# EAGLE design design (EAGLE 9.5.1)
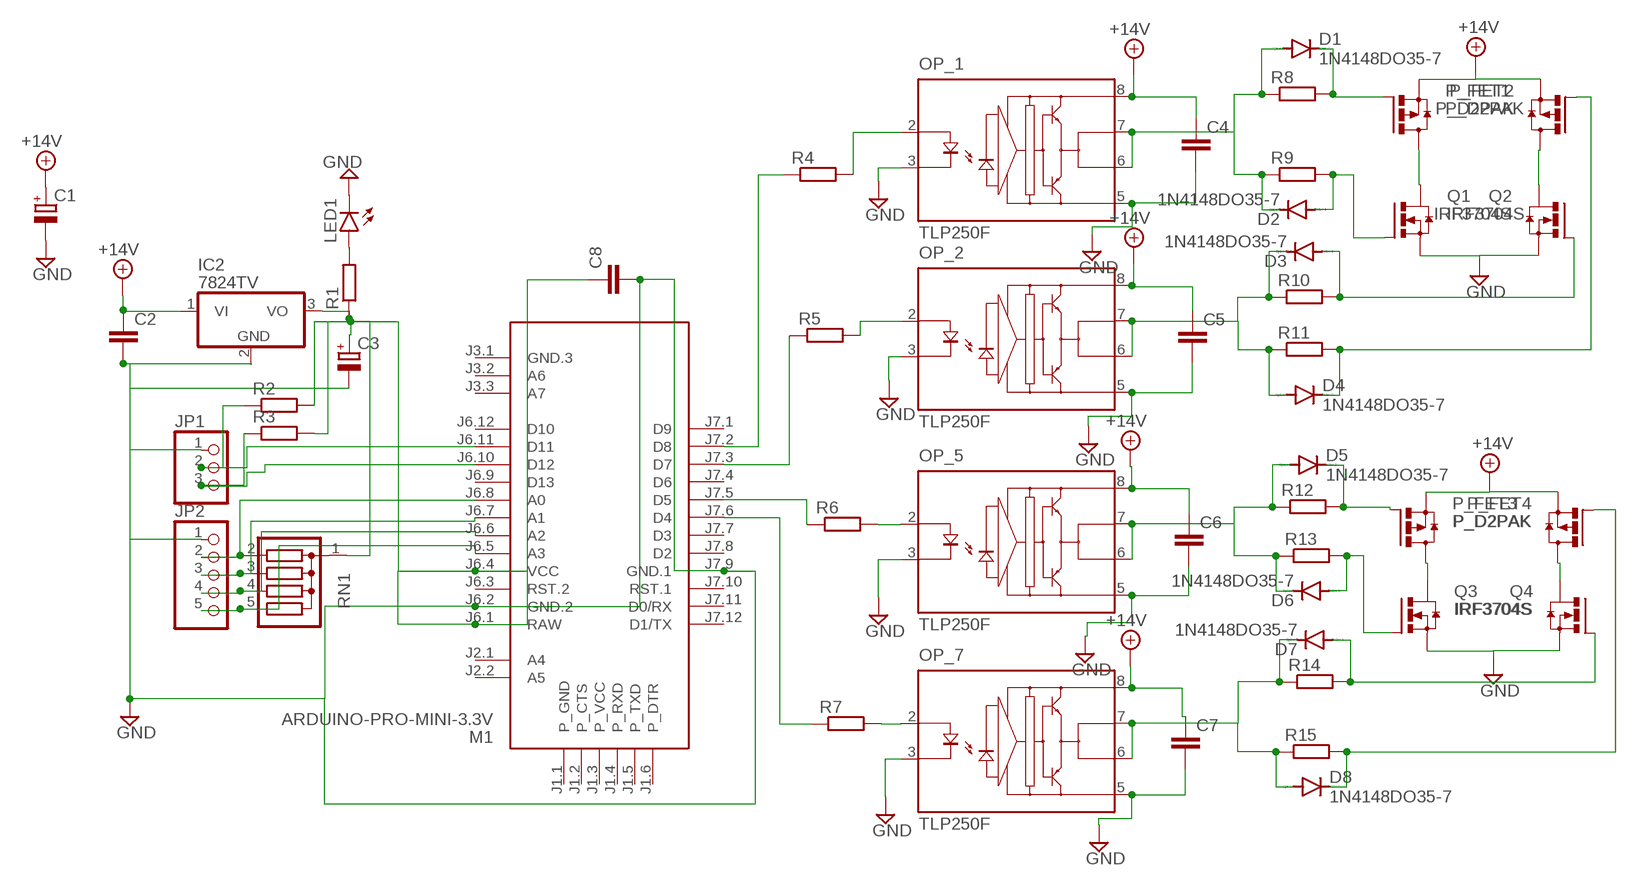
[diagram p0: schematic, sheet 1]

## Parts
C1  CPOL-EUE5-13  [E5-13]
C2  C-EU050-024X044  [C050-024X044]
C3  CPOL-EUE2.5-5  [E2,5-5]
C4  C-EU050-024X044  [C050-024X044]
C5  C-EU050-024X044  [C050-024X044]
C6  C-EU050-024X044  [C050-024X044]
C7  C-EU050-024X044  [C050-024X044]
C8  C-EU050-024X044  [C050-024X044]
D1  1N4148DO35-7  [DO35-7]
D2  1N4148DO35-7  [DO35-7]
D3  1N4148DO35-7  [DO35-7]
D4  1N4148DO35-7  [DO35-7]
D5  1N4148DO35-7  [DO35-7]
D6  1N4148DO35-7  [DO35-7]
D7  1N4148DO35-7  [DO35-7]
D8  1N4148DO35-7  [DO35-7]
IC2  7824TV  [TO220V]
JP1  PINHD-1X3  [1X03]
JP2  PINHD-1X5  [1X05]
LED1  LED5MM  [LED5MM]
M1  ARDUINO-PRO-MINI-3.3V  [ARDUINO-PRO-MINI]
OP_1  TLP250F  [DIL08]
OP_2  TLP250F  [DIL08]
OP_5  TLP250F  [DIL08]
OP_7  TLP250F  [DIL08]
P_FET1  P_D2PAK  [D2PACK]
P_FET2  P_D2PAK  [D2PACK]
P_FET3  P_D2PAK  [D2PACK]
P_FET4  P_D2PAK  [D2PACK]
Q1  IRF3704S  [D2PACK]
Q2  IRF3704S  [D2PACK]
Q3  IRF3704S  [D2PACK]
Q4  IRF3704S  [D2PACK]
R1  R-EU_0207/7  [0207/7]
R2  R-EU_0207/7  [0207/7]
R3  R-EU_0207/7  [0207/7]
R4  R-EU_0207/7  [0207/7]
R5  R-EU_0207/7  [0207/7]
R6  R-EU_0207/7  [0207/7]
R7  R-EU_0207/7  [0207/7]
R8  R-EU_0207/7  [0207/7]
R9  R-EU_0207/7  [0207/7]
R10  R-EU_0207/7  [0207/7]
R11  R-EU_0207/7  [0207/7]
R12  R-EU_0207/7  [0207/7]
R13  R-EU_0207/7  [0207/7]
R14  R-EU_0207/7  [0207/7]
R15  R-EU_0207/7  [0207/7]
RN1  G04R  [SIL5]

## Nets
+14V: C1.+ C2.1 C4.1 C5.1 C6.1 C7.1 IC2.1(VI) OP_1.8(VCC) OP_2.8(VCC) OP_5.8(VCC) OP_7.8(VCC) P_FET1.3(S) P_FET2.3(S) P_FET3.3(S) P_FET4.3(S)
GND: C1.- C2.2 C3.- C4.2 C5.2 C6.2 C7.2 C8.2 IC2.2(GND) JP1.1 JP2.1 LED1.K(C) M1.J6.2(GND.2) M1.J7.9(GND.1) OP_1.3(K) OP_1.5(GND) OP_2.3(K) OP_2.5(GND) OP_5.3(K) OP_5.5(GND) OP_7.3(K) OP_7.5(GND) Q1.3(S) Q2.3(S) Q3.3(S) Q4.3(S)
N$1: C3.+ C8.1 IC2.3(VO) M1.J6.1(RAW) M1.J6.4(VCC) R1.1 R2.2 R3.2 RN1.1
N$2: JP1.2 M1.J6.11(D11) R2.1
N$3: LED1.A R1.2
N$4: JP1.3 M1.J6.10(D12) R3.1
N$5: JP2.2 M1.J6.8(A0) RN1.2
N$6: JP2.3 M1.J6.7(A1) RN1.3
N$7: JP2.4 M1.J6.6(A2) RN1.4
N$8: M1.J7.2(D8) R4.1
N$9: OP_1.2(A) R4.2
N$10: M1.J7.3(D7) R5.1
N$11: M1.J7.5(D5) R6.1
N$12: OP_2.2(A) R5.2
N$13: OP_5.2(A) R6.2
N$14: OP_7.2(A) R7.2
N$15: M1.J7.6(D4) R7.1
N$17: D1.A D2.C OP_1.6(VO) OP_1.7(VO') R8.1 R9.1
N$18: D3.C D4.A OP_2.6(VO) OP_2.7(VO') R10.1 R11.1
N$19: D5.A D6.C OP_5.6(VO) OP_5.7(VO') R12.1 R13.1
N$20: D7.C D8.A OP_7.6(VO) OP_7.7(VO') R14.1 R15.1
N$21: P_FET3.2(D) Q3.2(D)
N$22: D3.A Q2.1(G) R10.2
N$23: D2.A Q1.1(G) R9.2
N$24: D4.C P_FET2.1(G) R11.2
N$25: D5.C P_FET3.1(G) R12.2
N$26: P_FET1.2(D) Q1.2(D)
N$27: D6.A Q3.1(G) R13.2
N$28: D7.A Q4.1(G) R14.2
N$29: P_FET2.2(D) Q2.2(D)
N$30: D8.C P_FET4.1(G) R15.2
N$31: P_FET4.2(D) Q4.2(D)
N$32: D1.C P_FET1.1(G) R8.2
N$33: JP2.5 M1.J6.5(A3) RN1.5
Unconnected: M1.J1.1(P_GND) M1.J1.2(P_CTS) M1.J1.3(P_VCC) M1.J1.4(P_RXD) M1.J1.5(P_TXD) M1.J1.6(P_DTR) M1.J2.1(A4) M1.J2.2(A5) M1.J3.1(GND.3) M1.J3.2(A6) M1.J3.3(A7) M1.J6.3(RST.2) M1.J6.9(D13) M1.J6.12(D10) M1.J7.1(D9) M1.J7.4(D6) M1.J7.7(D3) M1.J7.8(D2) M1.J7.10(RST.1) M1.J7.11(D0/RX) M1.J7.12(D1/TX)

## Library data of the parts
C1 C3 = rcl:CPOL-EU: POLARIZED CAPACITOR, European symbol; SPICEPREFIX: C
C2 C4-C8 = rcl:C-EU: CAPACITOR, European symbol; SPICEPREFIX: C
D1-D8 = diode:1N4148: DIODE high speed (Philips)
IC2 = linear:78*: Positive VOLTAGE REGULATOR Source: http://cache.national.com/ds/LM/LM78L05.pdf http://www.fairchildsemi.com/ds/LM/LM7805.pdf
JP1 = pinhead:PINHD-1X3: PIN HEADER
JP2 = pinhead:PINHD-1X5: PIN HEADER
LED1 = led:LED: LED OSRAM: - CHIPLED LG R971, LG N971, LY N971, LG Q971, LY Q971, LO R971, LY R971 LH N974, LH R974 LS Q976, LO Q976, LY Q976 LO Q996 - Hyper CHIPLED LW Q18S LB Q993, LB Q99A, LB R99A - SideLED LS A670, LO A670, LY A670, LG A670, LP A670 LB A673, LV A673, LT A673, LW A673 LH A674 LY A675 LS A676, LA A676, LO A676, LY A676, LW A676 LS A679, LY A679, LG A679 - Hyper Micro SIDELED® LS Y876, LA Y876, LO Y876, LY Y876 LT Y87S - SmartLED LW L88C, LW L88S LB L89C, LB L89S, LG L890 LS L89K, LO L89K, LY L89K LS L896, LA L896, LO L896, LY L896 - TOPLED LS T670, LO T670, LY T670, LG T670, LP T670 LSG T670, LSP T670, LSY T670, LOP T670, LYG T670 LG T671, LOG T671, LSG T671 LB T673, LV T673, LT T673, LW T673 LH T674 LS T676, LA T676, LO T676, LY T676, LB T676, LH T676, LSB T676, LW T676 LB T67C, LV T67C, LT T67C, LS T67K, LO T67K, LY T67K, LW E67C LS E67B, LA E67B, LO E67B, LY E67B, LB E67C, LV E67C, LT E67C LW T67C LS T679, LY T679, LG T679 LS T770, LO T770, LY T770, LG T770, LP T770 LB T773, LV T773, LT T773, LW T773 LH T774 LS E675, LA E675, LY E675, LS T675 LS T776, LA T776, LO T776, LY T776, LB T776 LHGB T686 LT T68C, LB T68C - Hyper Mini TOPLED® LB M676 - Mini TOPLED Santana® LG M470 LS M47K, LO M47K, LY M47K Source: http://www.osram.convergy.de LUXEON: - LUMILED® LXK2-PW12-R00, LXK2-PW12-S00, LXK2-PW14-U00, LXK2-PW14-V00 LXK2-PM12-R00, LXK2-PM12-S00, LXK2-PM14-U00 LXK2-PE12-Q00, LXK2-PE12-R00, LXK2-PE12-S00, LXK2-PE14-T00, LXK2-PE14-U00 LXK2-PB12-K00, LXK2-PB12-L00, LXK2-PB12-M00, LXK2-PB14-N00, LXK2-PB14-P00, LXK2-PB14-Q00 LXK2-PR12-L00, LXK2-PR12-M00, LXK2-PR14-Q00, LXK2-PR14-R00 LXK2-PD12-Q00, LXK2-PD12-R00, LXK2-PD12-S00 LXK2-PH12-R00, LXK2-PH12-S00 LXK2-PL12-P00, LXK2-PL12-Q00, LXK2-PL12-R00 Source: www.luxeon.com KINGBRIGHT: KA-3528ASYC Source: www.kingbright.com
M1 = diy-modules:ARDUINO-PRO-MINI-*: Arduino Pro Mini and compatible devices More details available here: https://www.arduino.cc/en/Main/ArduinoBoardProMini Click here to find device on ebay.com <http://www.ebay.com/sch/arduino+pro+mini>
OP_1 OP_2 OP_5 OP_7 = optocoupler-3-jcn:TLP250F: Toshiba Transistor Inverter Inverter For Air Conditionor IGBT Gate Drive Power MOS FET Gate Drive
P_FET1-P_FET4 = transistor-power:P_D2PAK
Q1 Q2 Q4 = transistor-power:IRF3704: SMPS MOSFET HEXFET® Power MOSFET Source: http://www.irf.com/product-info/datasheets/data/irf3704.pdf
Q3 = transistor-power:IRF3704: SMPS MOSFET HEXFET® Power MOSFET Source: http://www.irf.com/product-info/datasheets/data/irf3704.pdf; SPICEPREFIX: Q
R1-R15 = rcl:R-EU_: RESISTOR, European symbol; SPICEPREFIX: R
RN1 = resistor-sil:G04R: SIL RESISTOR; OC_FARNELL: unknown; OC_NEWARK: unknown

## Board
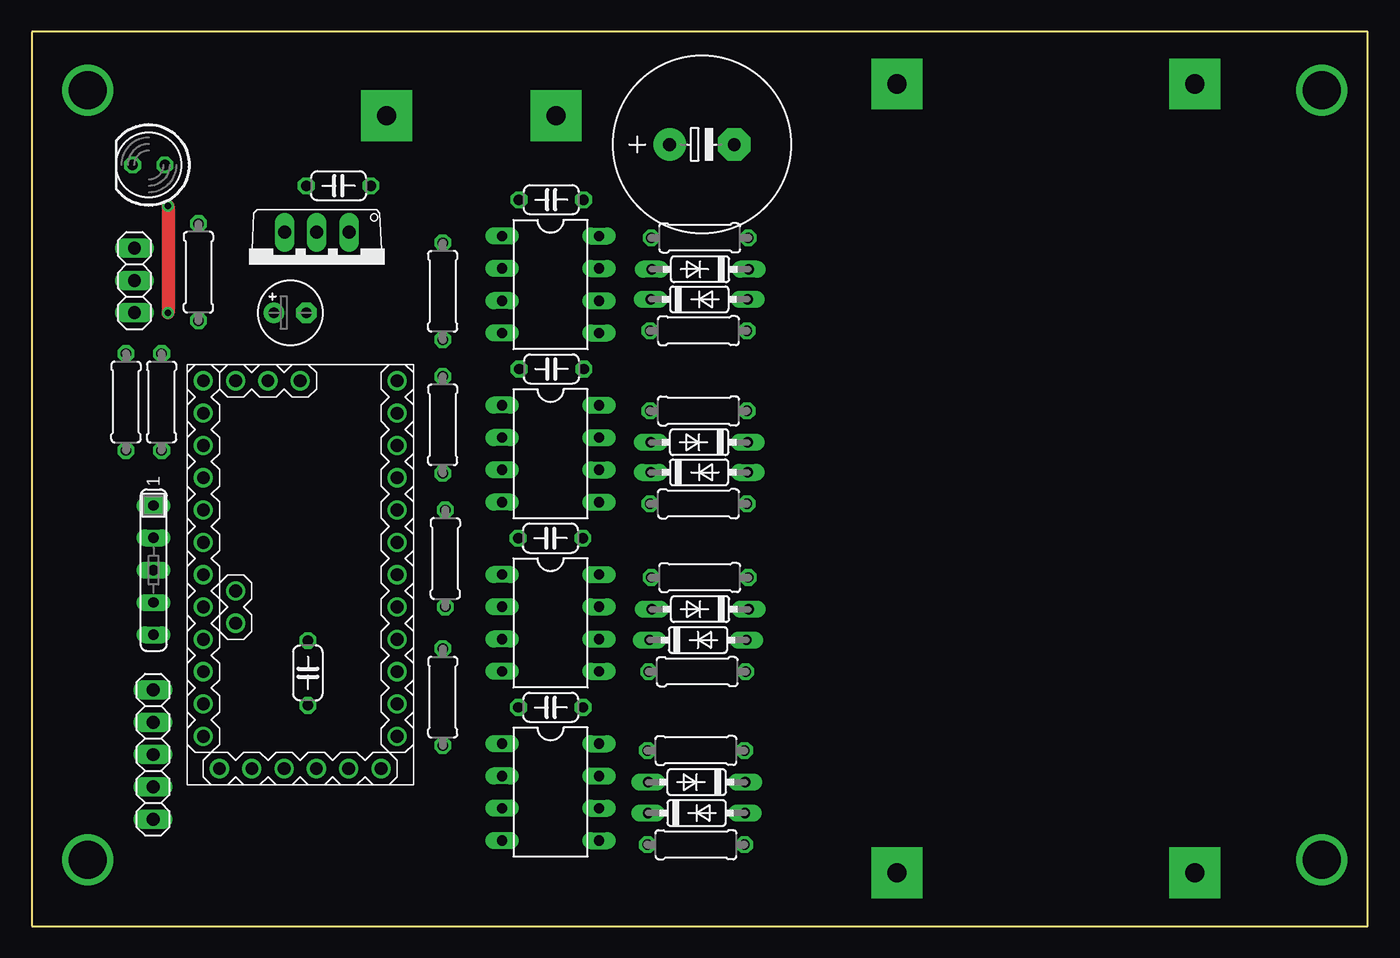
[diagram p1: board, top side]
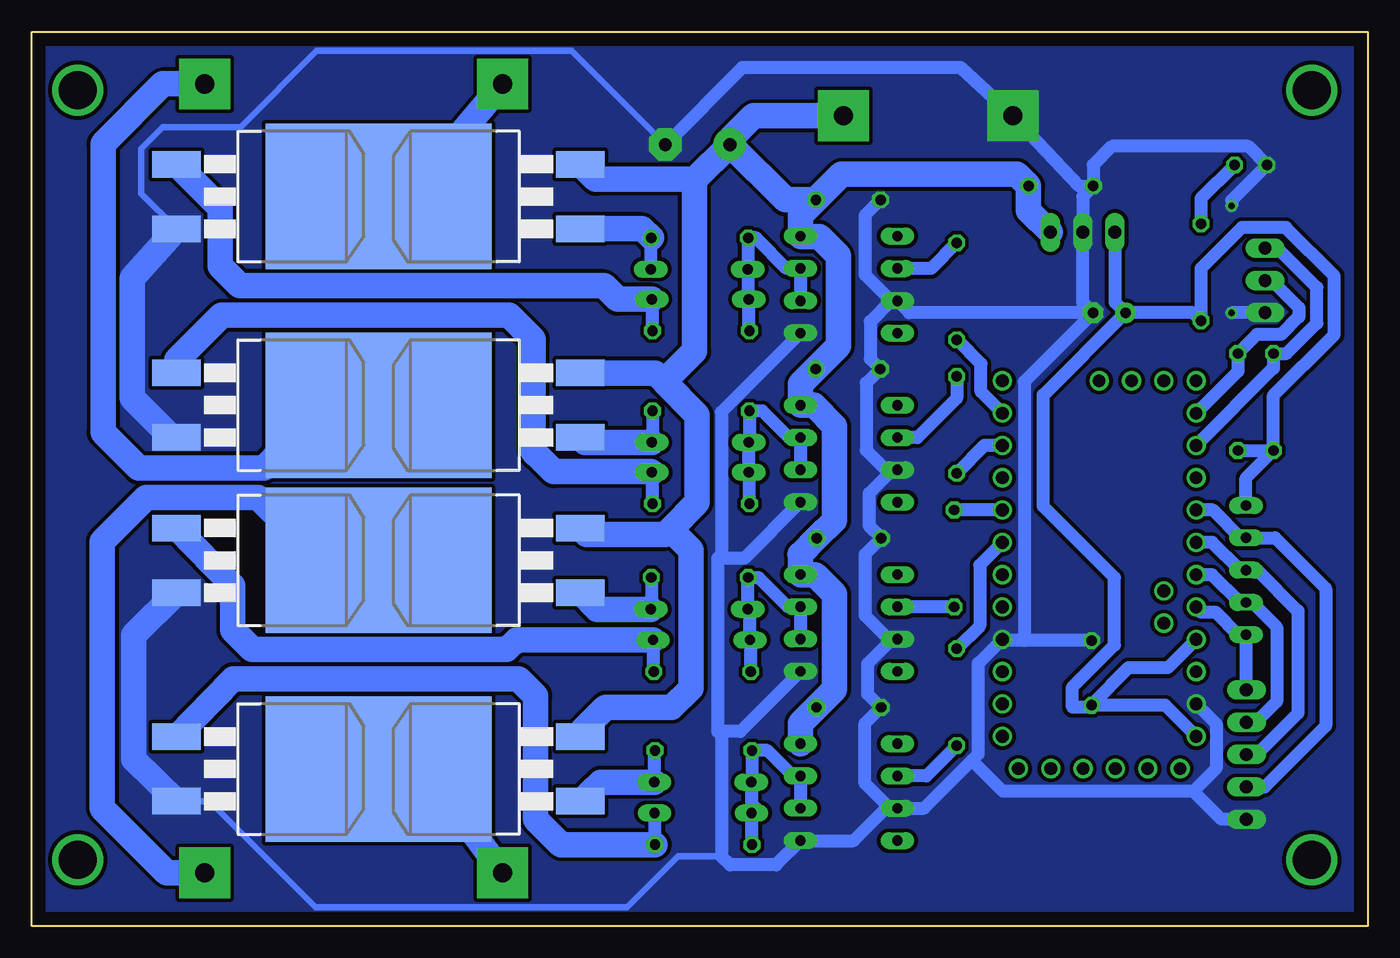
[diagram p2: board, bottom side, seen from below]

Size 105 x 70.3 mm. Coordinates in mm from the lower left corner, seen from the top.
Outline: 0,70.3 0,0 105,0 105,70.3 0,70.3
Copper layers (1*16): Top 0.035mm / dielectric 1.5mm / Bottom 0.035mm
Design rules "default *": minimum track width 6mil, minimum drill 0.35mm, track to track 0.3mm, track to pad 0.3mm, pad to pad 0.3mm, via to via 0.3mm, smd to smd 0.3mm, copper to edge 40mil, drill to drill 6mil, minimum pad ring 10mil, minimum via ring 8mil, stop-mask expansion 4mil, vias tented up to drill 0mil, thermal gap 10mil

### Footprints (pad centres in the part's own frame; a part is rotated, then mirrored left to right if it is on the bottom)
E5-13 = drill 1.016 pad 2.54: + -2.54,0 | drill 1.016 pad 2.54 octagon: - 2.54,0
C050-024X044 = drill 0.813 octagon: 1 -2.54,0; 2 2.54,0
E2,5-5 = drill 0.813 pad 1.6: + -1.27,0 | drill 0.813 pad 1.6 octagon: - 1.27,0
DO35-7 = drill 0.813 long: A 3.81,0; C -3.81,0
TO220V = drill 1.016 long: 1 -2.54,-2.54; 2 0,-2.54; 3 2.54,-2.54
1X03 = drill 1.016 long: 1 -2.54,0; 2 0,0; 3 2.54,0
1X05 = drill 1.016 long: 1 -5.08,0; 2 -2.54,0; 3 0,0; 4 2.54,0; 5 5.08,0
LED5MM = drill 0.813 octagon: A -1.27,0; K 1.27,0
ARDUINO-PRO-MINI = drill 1: J1.1 -15.24,6.35; J1.2 -15.24,3.81; J1.3 -15.24,1.27; J1.4 -15.24,-1.27; J1.5 -15.24,-3.81; J1.6 -15.24,-6.35; J2.1 -1.27,5.08; J2.2 -3.81,5.08; J3.1 15.24,0; J3.2 15.24,2.54; J3.3 15.24,5.08; J6.1 -12.7,7.62; J6.2 -10.16,7.62; J6.3 -7.62,7.62; J6.4 -5.08,7.62; J6.5 -2.54,7.62; J6.6 0,7.62; J6.7 2.54,7.62; J6.8 5.08,7.62; J6.9 7.62,7.62; J6.10 10.16,7.62; J6.11 12.7,7.62; J6.12 15.24,7.62; J7.1 15.24,-7.62; J7.2 12.7,-7.62; J7.3 10.16,-7.62; J7.4 7.62,-7.62; J7.5 5.08,-7.62; J7.6 2.54,-7.62; J7.7 0,-7.62; J7.8 -2.54,-7.62; J7.9 -5.08,-7.62; J7.10 -7.62,-7.62; J7.11 -10.16,-7.62; J7.12 -12.7,-7.62
DIL08 = drill 0.813 long: 1 -3.81,-3.81; 2 -1.27,-3.81; 3 1.27,-3.81; 4 3.81,-3.81; 5 3.81,3.81; 6 1.27,3.81; 7 -1.27,3.81; 8 -3.81,3.81
D2PACK = smd 2.083 x 3.81: 1 -2.54,-8.89; 3 2.54,-8.89 | smd 11.43 x 8.89: 2 0,2.54
0207/7 = drill 0.813 octagon: 1 -3.81,0; 2 3.81,0
SIL5 = drill 0.813 long: 1 -5.08,0; 2 -2.54,0; 3 0,0; 4 2.54,0; 5 5.08,0

### Placement (x,y rotation side)
C1  52.67,61.44 0 top
C2  24.11,58.19 180 top
C3  20.31,48.22 0 top
C4  40.83,57.09 180 top
C5  40.85,43.79 180 top
C6  40.77,30.49 180 top
C7  40.79,17.19 180 top
C8  21.7,19.9 90 top
D1  52.53,51.63 180 top
D2  52.46,49.27 0 top
D3  52.45,35.67 0 top
D4  52.46,38.03 180 top
D5  52.53,24.91 180 top
D6  52.36,22.49 0 top
D7  52.25,8.89 0 top
D8  52.26,11.31 180 top
IC2  22.4,52 180 top
JP1  8.07,50.75 90 top
JP2  9.53,13.48 90 top
LED1  9.19,59.83 180 top
M1  21.1,27.62 90 top
OP_1  40.77,50.43 270 top
OP_2  40.77,37.13 270 top
OP_5  40.77,23.83 270 top
OP_7  40.77,10.53 270 top
P_FET1  70.77,57.35 90 bottom
P_FET2  70.77,40.95 90 bottom
P_FET3  70.77,28.75 90 bottom
P_FET4  70.77,12.35 90 bottom
Q1  84.73,57.35 270 bottom
Q2  84.73,40.95 270 bottom
Q3  84.73,28.75 270 bottom
Q4  84.73,12.35 270 bottom
R1  13.1,51.4 90 top
R2  10.2,41.2 270 top
R3  7.4,41.2 270 top
R4  32.3,49.9 90 top
R5  32.3,39.4 90 top
R6  32.5,28.9 270 top
R7  32.3,18 270 top
R8  52.5,54.1 0 top
R9  52.4,46.8 0 top
R10  52.4,33.2 0 top
R11  52.4,40.5 0 top
R12  52.5,27.4 0 top
R13  52.3,20 0 top
R14  52.2,6.4 0 top
R15  52.2,13.8 0 top
RN1  9.57,27.98 270 top

### Tracks (layer width: path | path; a pad name or v marks a point on that pad's centre or on a via)
+14V  (via drill 1.5 pad 4)
  Bottom 2: 44.58,29.22 C6.1 41.9,31.9 41.9,39.3 43.54,40.94 OP_2.8 44.58,42.6 C5.1 41.6,45.58 41.6,52.7 43.1,54.2 44.54,54.2 OP_1.8 44.58,55.88 C4.1 | 44.58,29.22 OP_5.8 44.54,27.6 43.4,27.6 41.9,26.1 41.9,18.62 C7.1 44.58,15.94 OP_7.8 | 44.58,29.22 44.62,29.22 | C1.+ 45.78,57.09 C4.1 | C4.1 41.36,59.1 27.56,59.1 C2.1 26.65,56.25 IC2.1 | C1.+ 52.9,58.67 | 55.31,42.79 52.9,45.2 52.9,58.67 | 55.31,42.79 52.7,40.18 52.7,33.3 54.81,31.19 | P_FET3.3 61.38,30.79 55.21,30.79 54.81,31.19 | 54.81,31.19 53.2,29.58 53.2,18.7 54.7,17.2 59.9,17.2 61.78,15.32 P_FET4.3 | C1.+ 50.13,61.84 48.27,63.7 v41.2,63.7 | 52.9,58.67 52.93,58.7 60.69,58.7 P_FET1.3 | 55.31,42.79 56.01,43.49 P_FET2.3
GND  (via drill 0.5, 1.5 pad 4)
  Top 1.016: v10.7,56.6 v10.7,48.2
  Bottom 0.508: 50.8,5.5 54.22,5.5 58.23,1.49 82.69,1.49 91.01,9.81 Q4.3 | Q1.3 96.4,57.59 96.4,61.1 94.7,62.8 88.6,62.8 82.6,68.8 62.57,68.8 C1.-
  Bottom 1.016: 37.46,49.16 39.5,51.2 39.5,55.88 C4.2 | 37.46,49.16 39.1,47.52 39.1,44.58 C5.2 39.4,42.7 39.4,37.4 37.86,35.86 OP_2.3 37.36,35.86 39.2,34.02 39.2,31.46 C6.2 39.5,29.22 39.5,24.4 37.66,22.56 OP_5.3 37.36,22.56 39.3,20.62 39.3,18.24 C7.2 39.5,15.94 39.5,11.2 37.56,9.26 OP_7.3 | 37.46,49.16 OP_1.3 36.02,48.22 C3.- | OP_7.3 37.86,9.26 40.4,6.72 OP_7.5 46.5,4.8 50.1,4.8 50.8,5.5 50.8,15.3 | JP2.1 11.5,8.4 13.7,10.6 | 31.1,13.03 28.67,10.6 13.7,10.6 | M1.J7.9 30.6,20.66 30.6,13.53 31.1,13.03 | OP_7.3 34.87,9.26 31.1,13.03 | OP_1.5 50.8,40.4 50.8,28.9 | 50.8,28.9 49,28.9 OP_2.5 | 50.8,28.9 51.1,28.9 51.1,15.3 50.8,15.3 | 50.8,15.3 49.3,15.3 OP_5.5 | C2.2 21.58,59.82 20.1,61.3 9.39,61.3 LED1.K 10.7,57.05 v10.7,56.6 | C8.2 27,22.44 | 27,22.44 28.44,22.44 | C3.- 27,42.8 27,22.44 | C2.2 | C2.2 22.4,57.36 IC2.2 22.4,49.04 C3.- | JP1.1 v10.69,48.21 v10.7,48.2 | C1.- 49.15,67.5 32,67.5 v27.9,63.7 22.68,58.18 C2.2 | M1.J6.2 11.9,15.88 11.9,12.4 13.7,10.6
  Bottom 2: Q1.3 97.1,50.93 97.1,41.49 94.02,38.41 Q2.3 | Q4.3 97,13.11 97,22.9 Q3.3
  pour Bottom (no thermals): -0.5,70.8 -0.5,-0.4 105.5,-0.4 105.5,70.8
N$1
  Bottom 1.016: C3.+ 13.73,48.22 R1.1 13.1,51.7 9.89,54.91 6.42,54.91 2.63,51.12 2.63,46.48 7.4,41.71 R3.2 | R2.2 R3.2 | RN1.1 9.57,35.22 R3.2 | M1.J6.1 15.92,17.36 C8.1 21.7,17.4 | M1.J6.4 15.72,20.3 18.8,20.3 21.7,17.4 | C3.+ 25.5,41.76 25.5,33 19.9,27.4 19.9,22.1 23.2,18.8 23.2,17.2 21.9,17.2 21.7,17.4 | IC2.3 19.86,49.04 C3.+
N$2
  Bottom 1.016: M1.J6.11 10.2,43.6 R2.1 8.71,46.5 6.8,46.5 5.4,47.9 5.4,48.6 7.55,50.75 JP1.2
N$3
  Bottom 1.016: R1.2 13.1,57.19 LED1.A
N$4
  Bottom 1.016: M1.J6.10 7.4,43.86 R3.1 6.39,45.01 4,47.4 4,50.2 7.09,53.29 JP1.3
N$5
  Bottom 1.016: M1.J6.8 12.15,32.7 9.97,30.52 RN1.2 7.28,30.52 3.31,26.55 3.31,15.73 8.1,10.94 JP2.2
N$6
  Bottom 1.016: M1.J6.7 12.25,30.16 10.07,27.98 RN1.3 8.67,27.98 5.48,24.79 5.48,16.72 8.72,13.48 JP2.3
N$7
  Bottom 1.016: M1.J6.6 12.25,27.62 10.07,25.44 RN1.4 9.07,25.44 7.15,23.52 7.15,17.65 8.78,16.02 JP2.4
N$8
  Bottom 1.016: M1.J7.2 30.4,42 30.4,44.19 R4.1
N$9
  Bottom 1.016: R4.2 34.31,51.7 OP_1.2
N$10
  Bottom 1.016: M1.J7.3 30.11,37.78 R5.1
N$11
  Bottom 1.016: M1.J7.5 R6.1
N$12
  Bottom 1.016: R5.2 32.3,41.5 35.4,38.4 OP_2.2
N$13
  Bottom 1.016: R6.2 OP_5.2
N$14
  Bottom 1.016: R7.2 34.69,11.8 OP_7.2
N$15
  Bottom 1.016: M1.J7.6 30.5,28.38 30.5,23.61 R7.1
N$17
  Bottom 1.016: OP_1.6 OP_1.7 45.68,51.7 48.08,54.1 R8.1 48.72,54.07 D1.A 48.72,49.34 D2.C 48.65,46.86 R9.1
N$18
  Bottom 1.016: OP_2.6 OP_2.7 45.48,38.4 47.58,40.5 R11.1 48.59,38.07 D4.A | R10.1 48.59,35.62 D3.C D4.A | D4.A
N$19
  Bottom 1.016: OP_5.6 OP_5.7 45.58,25.1 47.85,27.37 48.72,27.37 | R13.1 48.49,22.43 D6.C 48.55,24.74 D5.A 48.72,27.37 | 48.72,27.37 R12.1
N$20
  Bottom 1.016: OP_7.6 OP_7.7 45.18,11.8 47.18,13.8 R15.1 48.39,11.37 D8.A D7.C | R14.1 48.39,8.84 D7.C | 48.09,9.26 D7.C
N$21  (via drill 1.5 pad 4)
  Bottom 2: P_FET3.2 Q3.2 87.23,33.68 96.01,33.68 99.45,30.24 99.45,9.27 94.39,4.2 v91.4,4.2
N$22
  Bottom 1.016: D3.A 56.26,33.25 R10.2
  Bottom 2: Q2.1 93.62,44.49 90.09,48.02 67.49,48.02 65.6,46.13 65.6,37.3 65.3,37 65.25,37 63.98,35.73 56.32,35.73 D3.A
N$23
  Bottom 1.016: D2.A 56.27,46.86 R9.2
  Bottom 2: Q1.1 90.2,56.47 90.2,51.86 88.67,50.34 60.03,50.34 58.97,49.27 D2.A
N$24
  Bottom 1.016: R11.2 56.21,38.09 D4.C
  Bottom 2: D4.C 61.5,38.03 P_FET2.1
N$25
  Bottom 1.016: R12.2 56.31,24.94 D5.C
  Bottom 2: D5.C 60.58,24.91 P_FET3.1
N$26  (via drill 1.5 pad 4)
  Bottom 2: 72.9,57.26 P_FET1.2 Q1.2 75.86,56.85 v68,66.2
N$27
  Bottom 1.016: D6.A 56.17,20.06 R13.2
  Bottom 2: Q3.1 89.2,26.77 89.2,23.27 87.67,21.73 67.67,21.73 66.91,22.49 D6.A
N$28
  Bottom 1.016: R14.2 56.01,8.84 D7.A
  Bottom 2: R14.2 63.4,6.4 65.4,8.4 65.4,18.1 66.73,19.43 89.18,19.43 Q4.1
N$29  (via drill 1.5 pad 4)
  Bottom 2: P_FET2.2 73.42,40.55 Q2.2 86.76,36 96.6,36 99.4,38.8 99.4,61.5 94.7,66.2 v91.4,66.2
N$30
  Bottom 1.016: D8.C 56.07,13.74 R15.2
  Bottom 2: D8.C 60.28,11.31 P_FET4.1
N$31  (via drill 1.5 pad 4)
  Bottom 2: Q4.2 P_FET4.2 73.21,11.3 v68,4.2
N$32
  Bottom 1.016: D1.C 56.34,54.07 R8.2
  Bottom 2: R8.2 57.02,54.81 P_FET1.1
N$33
  Bottom 1.016: M1.J6.5 13.08,24.68 11.95,24.68 10.17,22.9 RN1.5 9.53,22.86 JP2.5
N$37  (via drill 3)
  other vias: 4.4,65.7
N$38  (via drill 3)
  other vias: 101.4,65.7
N$39  (via drill 3)
  other vias: 101.4,5.2
N$40  (via drill 3)
  other vias: 4.4,5.2